# EAGLE design OpenthermGWMini (EAGLE 7.4.0)
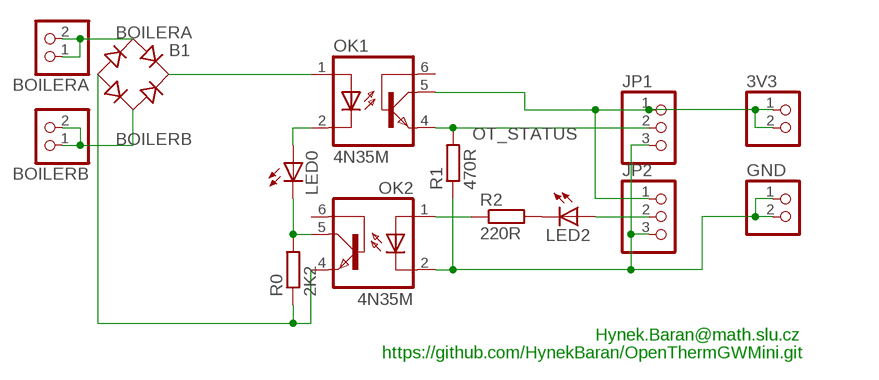
[diagram p0: schematic, sheet 1]

## Parts
3V3  PINHD-1X2  [1X02]
B1  RB1A  [RB1A]
BOILERA  PINHD-1X2  [1X02]
BOILERB  PINHD-1X2  [1X02]
GND  PINHD-1X2  [1X02]
JP1  PINHD-1X3  [1X03]
JP2  PINHD-1X3  [1X03]
LED0  LED3MM  [LED3MM]
LED2  LED3MM  [LED3MM]
OK1  4N35M  [DIL06]
OK2  4N35M  [DIL06]
R0  2K2  R-EU_0204/5  [0204/5]
R1  470R  R-EU_0204/5  [0204/5]
R2  220R  R-EU_0204/5  [0204/5]

## Nets
3V3 [VCC]: 3V3.1 3V3.2 JP1.1 JP2.1 OK1.5(COL)
BOILERA [BOILER]: B1.AC1 BOILERA.1 BOILERA.2
BOILERB [BOILER]: B1.AC2 BOILERB.1 BOILERB.2
GND [VCC]: GND.1 GND.2 JP1.3 JP2.3 OK2.2(C) R1.1
N$2 [BOILER]: LED0.K(C) OK2.5(COL) R0.2
N$3: LED0.A OK1.2(C)
N$4: OK2.1(A) R2.1
N$5: LED2.K(C) R2.2
OT+ [BOILER]: B1.+ OK1.1(A)
OT_GND [BOILER]: B1.- OK2.4(EMI) R0.1
OT_PWM: JP2.2 LED2.A
OT_STATUS: JP1.2 OK1.4(EMI) R1.2
Unconnected: OK1.6(BAS) OK2.6(BAS)

## Notes on the sheet
- Hynek.Baran@math.slu.cz
- https://github.com/HynekBaran/OpenThermGWMini.git

## Library data of the parts
3V3 GND = pinheadHB:PINHD-1X2: PIN HEADER
B1 = rectifier:RB1A: RECTIFIER 1 A
BOILERA BOILERB = pinhead:PINHD-1X2: PIN HEADER
JP1 JP2 = pinheadHB:PINHD-1X3: PIN HEADER
LED0 LED2 = led:LED: LED OSRAM: - CHIPLED LG R971, LG N971, LY N971, LG Q971, LY Q971, LO R971, LY R971 LH N974, LH R974 LS Q976, LO Q976, LY Q976 LO Q996 - Hyper CHIPLED LW Q18S LB Q993, LB Q99A, LB R99A - SideLED LS A670, LO A670, LY A670, LG A670, LP A670 LB A673, LV A673, LT A673, LW A673 LH A674 LY A675 LS A676, LA A676, LO A676, LY A676, LW A676 LS A679, LY A679, LG A679 - Hyper Micro SIDELED® LS Y876, LA Y876, LO Y876, LY Y876 LT Y87S - SmartLED LW L88C, LW L88S LB L89C, LB L89S, LG L890 LS L89K, LO L89K, LY L89K LS L896, LA L896, LO L896, LY L896 - TOPLED LS T670, LO T670, LY T670, LG T670, LP T670 LSG T670, LSP T670, LSY T670, LOP T670, LYG T670 LG T671, LOG T671, LSG T671 LB T673, LV T673, LT T673, LW T673 LH T674 LS T676, LA T676, LO T676, LY T676, LB T676, LH T676, LSB T676, LW T676 LB T67C, LV T67C, LT T67C, LS T67K, LO T67K, LY T67K, LW E67C LS E67B, LA E67B, LO E67B, LY E67B, LB E67C, LV E67C, LT E67C LW T67C LS T679, LY T679, LG T679 LS T770, LO T770, LY T770, LG T770, LP T770 LB T773, LV T773, LT T773, LW T773 LH T774 LS E675, LA E675, LY E675, LS T675 LS T776, LA T776, LO T776, LY T776, LB T776 LHGB T686 LT T68C, LB T68C - Hyper Mini TOPLED® LB M676 - Mini TOPLED Santana® LG M470 LS M47K, LO M47K, LY M47K Source: http://www.osram.convergy.de LUXEON: - LUMILED® LXK2-PW12-R00, LXK2-PW12-S00, LXK2-PW14-U00, LXK2-PW14-V00 LXK2-PM12-R00, LXK2-PM12-S00, LXK2-PM14-U00 LXK2-PE12-Q00, LXK2-PE12-R00, LXK2-PE12-S00, LXK2-PE14-T00, LXK2-PE14-U00 LXK2-PB12-K00, LXK2-PB12-L00, LXK2-PB12-M00, LXK2-PB14-N00, LXK2-PB14-P00, LXK2-PB14-Q00 LXK2-PR12-L00, LXK2-PR12-M00, LXK2-PR14-Q00, LXK2-PR14-R00 LXK2-PD12-Q00, LXK2-PD12-R00, LXK2-PD12-S00 LXK2-PH12-R00, LXK2-PH12-S00 LXK2-PL12-P00, LXK2-PL12-Q00, LXK2-PL12-R00 Source: www.luxeon.com KINGBRIGHT: KA-3528ASYC Source: www.kingbright.com
OK1 OK2 = optocoupler:4N*?M: General Purpose 6-Pin Phototransistor Optocouplers Source: http://www.fairchildsemi.com/ds/4N/4N35-M.pdf; MPN: 4N35-M; OC_FARNELL: 1021351; OC_NEWARK: 98K9114
R0 R1 R2 = resistor:R-EU_: RESISTOR, European symbol

## Net classes
1 BOILER: width 0.635 mm, clearance 0.254 mm
2 VCC: width 0.254 mm, clearance 0.127 mm

## Board
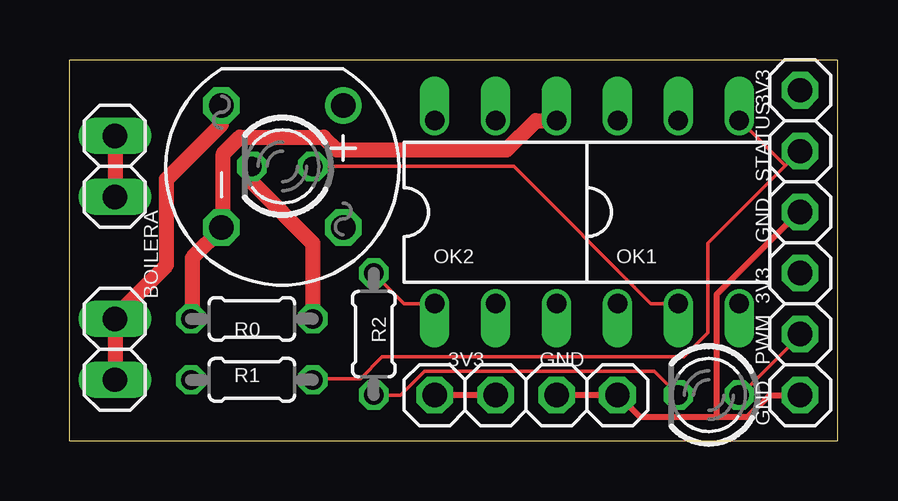
[diagram p1: board, top side]
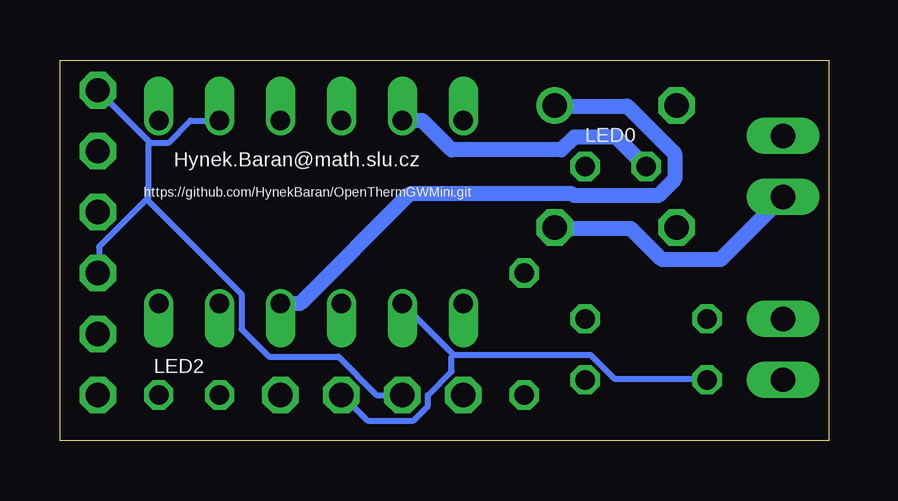
[diagram p2: board, bottom side, seen from below]

Size 32.05 x 15.87 mm. Coordinates in mm from the lower left corner, seen from the top.
Outline: 0,0 32.05,0 32.05,15.87 0,15.87 0,0
Copper layers (1*16): Top 0.0356mm / dielectric 1.5011mm / Bottom 0.0356mm
Design rules "LaenPCBOrder": minimum track width 6mil, minimum drill 13mil, track to track 6mil, track to pad 6mil, pad to pad 6mil, via to via 6mil, smd to smd 6mil, copper to edge 15mil, drill to drill 6mil, minimum pad ring 7mil, minimum via ring 7mil, stop-mask expansion 3mil, vias tented up to drill 0mil, thermal gap 10mil

### Footprints (pad centres in the part's own frame; a part is rotated, then mirrored left to right if it is on the bottom)
1X02 = drill 1.016 octagon: 1 -1.27,0; 2 1.27,0
RB1A = drill 1.016: + -2.54,2.54 | drill 1.016 octagon: - 2.54,-2.54; AC1 2.54,2.54; AC2 -2.54,-2.54
1X02' = drill 1.016 long: 1 -1.27,0; 2 1.27,0
1X03 = drill 1.016 octagon: 1 -2.54,0; 2 0,0; 3 2.54,0
LED3MM = drill 0.813 octagon: A -1.27,0; K 1.27,0
DIL06 = drill 0.813 offset: 1 -2.54,-3.81; 2 0,-3.81; 3 2.54,-3.81; 4 2.54,3.81; 5 0,3.81; 6 -2.54,3.81
0204/5 = drill 0.813 octagon: 1 -2.54,0; 2 2.54,0

### Placement (x,y rotation side)
3V3  16.51,1.91 0 top
B1  8.89,11.43 270 top
BOILERA  [1X02']  1.91,11.43 90 top
BOILERB  [1X02']  1.91,3.81 90 top
GND  21.59,1.91 0 top
JP1  30.48,12.07 270 top
JP2  30.48,4.45 270 top
LED0  8.89,11.43 180 top
LED2  26.67,1.91 180 top
OK1  25.4,9.52 0 top
OK2  17.78,9.52 0 top
R0  7.62,5.08 0 top
R1  7.62,2.54 0 top
R2  12.7,4.45 270 top

### Tracks (layer width: path | path; a pad name or v marks a point on that pad's centre or on a via)
3V3
  Top 0.254: 3V3.2 3V3.1
  Bottom 0.254: OK1.5 26.62,13.34 27.53,12.42 28.3,12.42 | JP1.1 28.3,12.42 | 28.45,10.06 28.37,10.14 28.37,12.34 28.3,12.42 | 28.45,10.06 30.43,8.08 30.43,7.01 JP2.1 | 3V3.2 18.85,1.91 20.45,3.51 23.34,3.51 24.49,4.65 24.49,6.1 28.45,10.06
BOILERA
  Top 0.635: BOILERA.1 1.93,10.21 1.93,12.65 BOILERA.2
  Bottom 0.635: BOILERA.1 4.52,7.54 6.96,7.54 8.26,8.84 11.38,8.84 B1.AC1
BOILERB
  Top 0.635: BOILERB.1 1.93,2.59 1.93,5.03 BOILERB.2 2.08,5.33 4.06,7.32 4.06,10.9 6.35,13.18 B1.AC2
GND
  Top 0.254: GND.1 GND.2 22.96,1.83 23.8,0.99 27,0.99 | JP2.3 29.21,1.91 28.3,0.99 27,0.99 | 27,0.99 27,6.1 30.43,9.52 JP1.3
  Bottom 0.254: 15.65,3.58 9.93,3.58 8.94,2.59 5.13,2.59 R1.1 | OK2.2 15.65,3.58 | 15.65,3.58 15.72,3.51 15.72,2.9 16.71,1.91 16.71,1.45 17.32,0.84 19.23,0.84 20.3,1.91 GND.1
N$2
  Top 0.635: R0.2 10.16,8.23 7.64,10.74 7.64,11.43 LED0.K
  Bottom 0.635: OK2.5 16.94,13.34 15.72,12.12 11.15,12.12 10.62,12.65 8.87,12.65 7.64,11.43 LED0.K
N$3
  Top 0.152: OK1.2 24.26,5.72 18.54,11.43 LED0.A
N$4
  Top 0.152: OK2.1 13.97,5.72 R2.1
N$5
  Top 0.152: R2.2 13.82,1.91 14.81,2.9 24.41,2.9 LED2.K
OT+
  Bottom 0.635: OK1.1 22.05,5.72 17.48,10.29 10.69,10.29 10.62,10.21 7.11,10.21 6.43,10.9 6.43,11.96 8.41,13.95 11.38,13.95 B1.+
OT_GND
  Top 0.635: R0.1 5.13,5.11 5.13,7.62 6.35,8.84 B1.- 6.43,9.14 6.43,11.96 7.11,12.65 10.62,12.65 11.15,12.12 18.24,12.12 19.46,13.34 OK2.4
OT_PWM
  Top 0.152: LED2.A 27.99,1.91 30.51,4.42 JP2.2
OT_STATUS
  Top 0.152: 29.86,11.47 30.43,12.04 JP1.2 | 29.86,11.47 26.62,8.23 26.62,4.5 25.63,3.51 13.06,3.51 12.14,2.59 10.16,2.59 R1.2 | 29.86,11.47 27.99,13.34 OK1.4

### Text on the board
tNames: 3V3 | STATUS | GND | 3V3 | PWM | GND
bNames: Hynek.Baran@math.slu.cz | https://github.com/HynekBaran/OpenThermGWMini.git